# Altium schematic sheet Power.SchDoc
size B
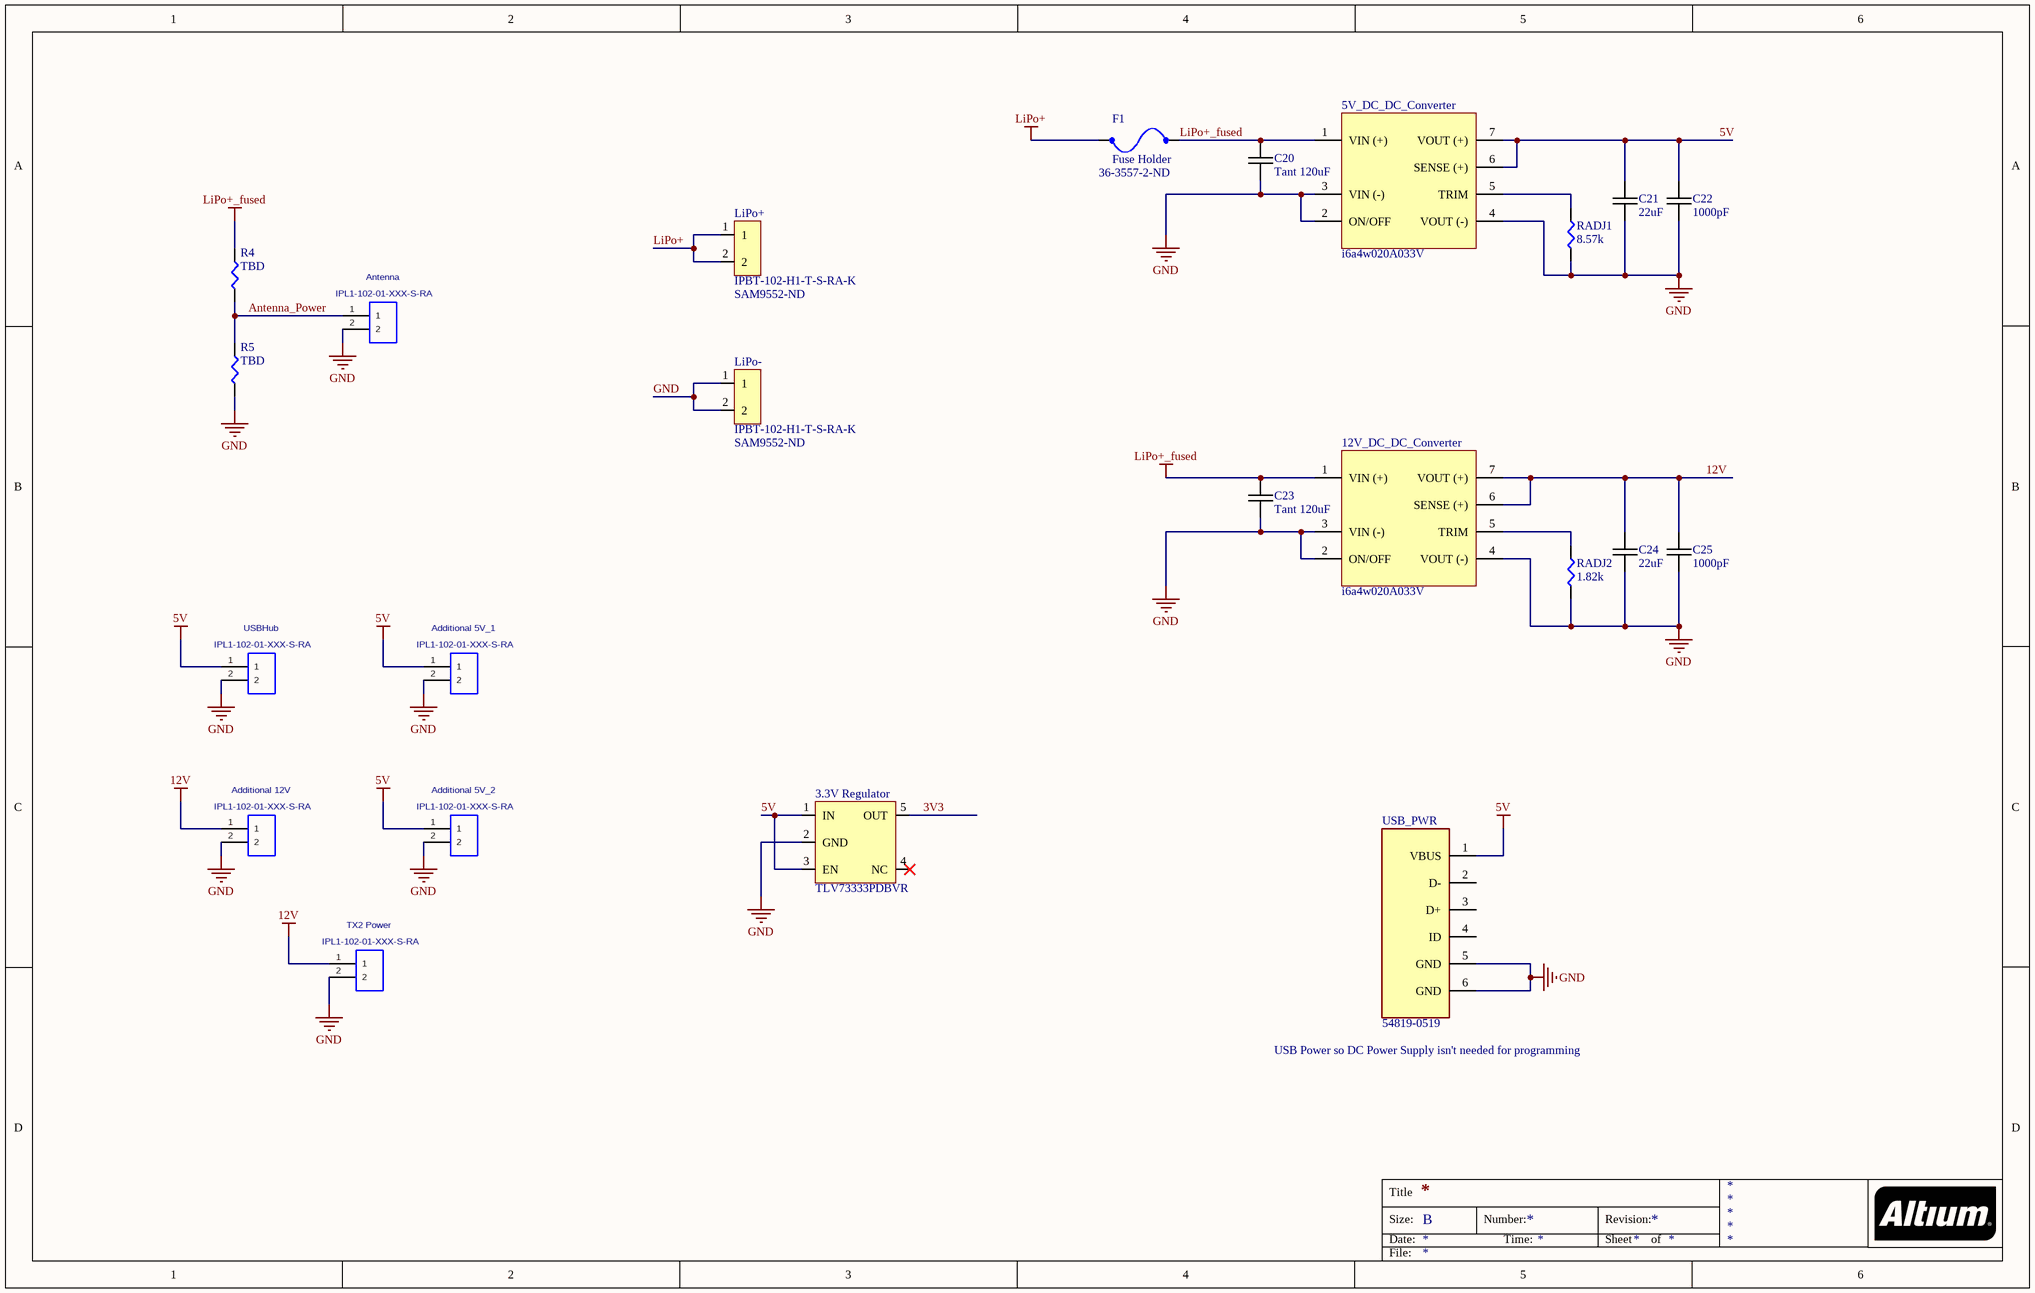
[diagram p0: Power.SchDoc]

## Parts
3.3V_Regulator  TLV73333PDBVR  [TLV733P]
5V_DC_DC_Converter  i6a4w020A033V  [i6a4w020A033V-001-R]
12V_DC_DC_Converter  i6a4w020A033V  [i6a4w020A033V-001-R]
Additional_5V_1  IPL1-102-01-XXX-S-RA  [IPL1-102-01-XXX-S-RA]
Additional_5V_2  IPL1-102-01-XXX-S-RA  [IPL1-102-01-XXX-S-RA]
Additional_12V  IPL1-102-01-XXX-S-RA  [IPL1-102-01-XXX-S-RA]
Antenna  IPL1-102-01-XXX-S-RA  [IPL1-102-01-XXX-S-RA]
C20  Tant 120uF  [0805C-GENERIC]
C21  22uF  [0805C-GENERIC]
C22  1000pF  [0805C-GENERIC]
C23  Tant 120uF  [0805C-GENERIC]
C24  22uF  [0805C-GENERIC]
C25  1000pF  [0805C-GENERIC]
F1  Fuse Holder  Supplier Part Number 1: 36-3557-2-ND  [Fuse Holder]
LiPo+  IPBT-102-H1-T-S-RA-K  Supplier Part Number 1: SAM9552-ND  [IPBT-102-H1-T-S-RA-K]
LiPo-  IPBT-102-H1-T-S-RA-K  Supplier Part Number 1: SAM9552-ND  [IPBT-102-H1-T-S-RA-K]
R4  TBD  [0805R-GENERIC]
R5  TBD  [0805R-GENERIC]
RADJ1  8.57k  [0805R-GENERIC]
RADJ2  1.82k  [0805R-GENERIC]
TX2_Power  IPL1-102-01-XXX-S-RA  [IPL1-102-01-XXX-S-RA]
USB_PWR  Part Number: 54819-0519  [Molex_54819-0519_0]  (hidden comment: Conn_Molex_54819-0519_eec)
USBHub  IPL1-102-01-XXX-S-RA  [IPL1-102-01-XXX-S-RA]

## Nets
5V: 3.3V_Regulator.1(IN) 3.3V_Regulator.3(EN) 5V_DC_DC_Converter.6(SENSE_(+)) 5V_DC_DC_Converter.7(VOUT_(+)) Additional_5V_1.1 Additional_5V_2.1 C21.1 C22.1 USB_PWR.1(VBUS) USBHub.1
12V: 12V_DC_DC_Converter.6(SENSE_(+)) 12V_DC_DC_Converter.7(VOUT_(+)) Additional_12V.1 C24.1 C25.1 TX2_Power.1
GND: 3.3V_Regulator.2(GND) 5V_DC_DC_Converter.2(ON/OFF) 5V_DC_DC_Converter.3(VIN_(-)) 5V_DC_DC_Converter.4(VOUT_(-)) 12V_DC_DC_Converter.2(ON/OFF) 12V_DC_DC_Converter.3(VIN_(-)) 12V_DC_DC_Converter.4(VOUT_(-)) Additional_5V_1.2 Additional_5V_2.2 Additional_12V.2 Antenna.2 C20.2 C21.2 C22.2 C23.2 C24.2 C25.2 LiPo-.1 LiPo-.2 R5.1 RADJ1.2 RADJ2.2 TX2_Power.2 USB_PWR.5(GND) USB_PWR.6(GND) USBHub.2
LiPo+: F1.1 LiPo+.1 LiPo+.2
LiPo+_fused: 5V_DC_DC_Converter.1(VIN_(+)) 12V_DC_DC_Converter.1(VIN_(+)) C20.1 C23.1 F1.2 R4.2
3V3: 3.3V_Regulator.5(OUT)
Antenna_Power: Antenna.1 R4.1 R5.2
Net5V_DC_DC_Converter_5: 5V_DC_DC_Converter.5(TRIM) RADJ1.1
Net12V_DC_DC_Converter_5: 12V_DC_DC_Converter.5(TRIM) RADJ2.1

Not connected (* = marked no-connect by the designer): 3.3V_Regulator 4(NC)*; USB_PWR 2(D-) 3(D+) 4(ID)

## Notes on the sheet
- USB Power so DC Power Supply isn't needed for programming
- Title
- Size:
- Date:
- B
- Number:
- Time:
- Revision:
- Sheet
- of
- File:

## Library data of the parts
3.3V_Regulator = TLV733
5V_DC_DC_Converter 12V_DC_DC_Converter = i6a4w020A033V-001-R: TDK-Lambda DC/DC Converter; Supplier 1: Digi-Key; Supplier Part Number 1: i6a4w020A033V
Additional_5V_1 Additional_5V_2 Additional_12V Antenna TX2_Power USBHub = IPL1-102-01-XXX-S-RA: Terminal Assembly, Single Row, Right Angle, Thru-Hole, 2 Pins.; MANUFACTURER: SAMTEC; CREATED: February 14, 2016 - Wendy Xin; PCB DECAL: IPL1-102-01-XXX-S-RA
C20-C25 = 0805C-TBD: CAPACITOR 0805 CERAMIC VALUE TO BE DETERMINED
R4 R5 RADJ1 RADJ2 = 0805R-TBD: RESISTOR 0805 VALUE TO BE DETERMINED
USB_PWR = Conn_Molex_54819-0519_eec: CONN USB - mini B USB 2.0 OTG Receptacle Connector 5 Position Through Hole, Right Angle; Manufacturer: Molex; Is Female: yes; helpURL: https://upverter.com/upn/revision/57f7d65304c3d878/; ComponentLink2Description: Datasheet; Temperature: -20°C to +85°C; Package: CONN_PTH_7MM7_9MM0_USB; Supplier 2: Mouser; Supplier 1: Digi-Key; ComponentLink1URL: https://upverter.com/upn/revision/57f7d65304c3d878/; Supplier Part Number 2: 538-54819-0519; Supplier Part Number 1: WM17115-ND; ComponentLink1Description: Upverter; ComponentLink2URL: https://upverter.com/datasheet/9d71f2f8719b3fc0715bd6f9e6d9d5a5d296bb87.pdf; RoHS: TRUE; Mouser Part Number: 538-54819-0519; Temperature Range High: +85°C; Digikey Description: CONN USB - mini B USB 2.0 OTG Receptacle Connector 5 Position Through Hole, Right Angle; Digikey Part Number: WM17115-ND; Lead Free: yes; Temperature Range Low: -20°C
F1 = Fuse Holder: Supplier 1: Digi-Key
LiPo+ LiPo- = IPBT-102-H1-T-S-RA-K: Supplier 1: Digi-Key